# EAGLE schematic baseband_amp (EAGLE 6.5.0)
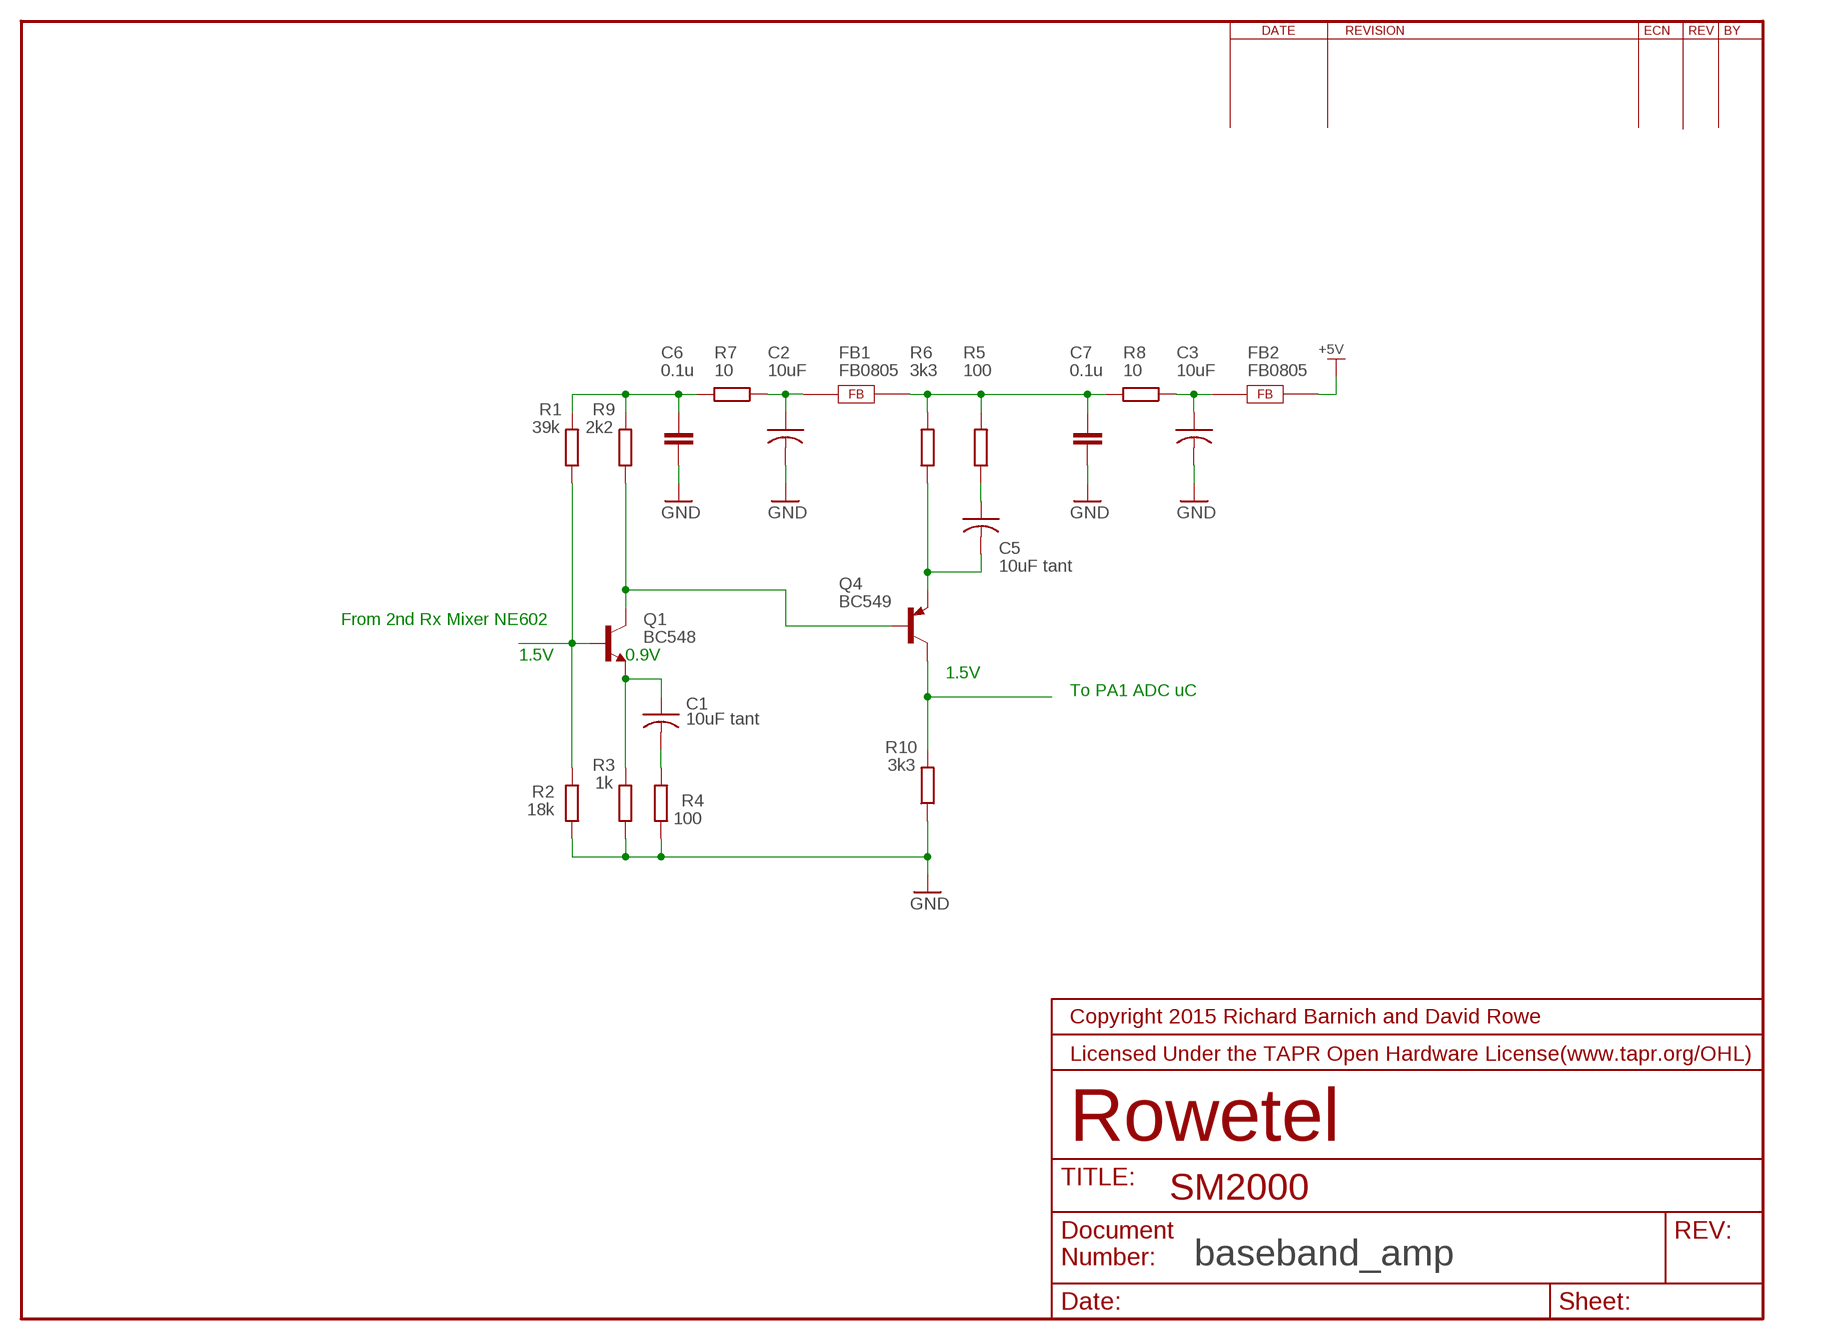
[diagram p0: schematic, sheet 1]

## Parts
C1  10uF tant  CAP-1210  [C1210]
C2  10uF  CAP-1210  [C1210]
C3  10uF  CAP-1210  [C1210]
C5  10uF tant  CAP-1210  [C1210]
C6  0.1u  C-EU025-024X044  [C025-024X044]
C7  0.1u  C-EU025-024X044  [C025-024X044]
FB1  FB0805  [FE0805]
FB2  FB0805  [FE0805]
Q1  BC548  -NPN-SOT23-EBC  [SOT23-EBC]
Q4  BC549  2N2905  [TO5]
R1  39k  RESISTOR_0805  [RESC2012X70N]
R2  18k  RESISTOR_0805  [RESC2012X70N]
R3  1k  RESISTOR_0805  [RESC2012X70N]
R4  100  RESISTOR_0805  [RESC2012X70N]
R5  100  RESISTOR_0805  [RESC2012X70N]
R6  3k3  RESISTOR_0805  [RESC2012X70N]
R7  10  RESISTOR_0805  [RESC2012X70N]
R8  10  RESISTOR_0805  [RESC2012X70N]
R9  2k2  RESISTOR_0805  [RESC2012X70N]
R10  3k3  RESISTOR_0805  [RESC2012X70N]

## Nets
+12V: FB2.2 ; supply symbol labelled +5V
GND: C2.2 C3.2 C6.2 C7.2 R2.1 R3.1 R4.1 R10.1
N$1: C1.1 Q1.E R3.2
N$2: C5.2 Q4.1(E) R6.1
N$3: Q1.B R1.1 R2.2
N$4: C7.1 FB1.2 R5.2 R6.2 R8.2
N$5: C3.1 FB2.1 R8.1
N$7: C2.1 FB1.1 R7.1
N$8: C1.2 R4.2
N$9: Q1.C Q4.2(B) R9.1
N$10: C6.1 R1.2 R7.2 R9.2
N$13: C5.1 R5.1
N$14: Q4.3(C) R10.2

## Notes on the sheet
- From 2nd Rx Mixer NE602
- 1.5V | 0.9V
- 1.5V
- To PA1 ADC uC
- SM2000

## Library data of the parts
C1-C3 C5 = _RoweTel:CAP-1210
C6 C7 = rcl:C-EU: CAPACITOR, European symbol
FB1 FB2 = _RoweTel:FB0805
Q1 = transistor:*-NPN-: NPN Transistror BF959 corrected 2008.03.06
Q4 = transistor-pnp:2N2905: PNP Transistor
R1-R10 = AA-ipc-7351-resistor:RESISTOR_